# Altium project pic development board.PrjPcb
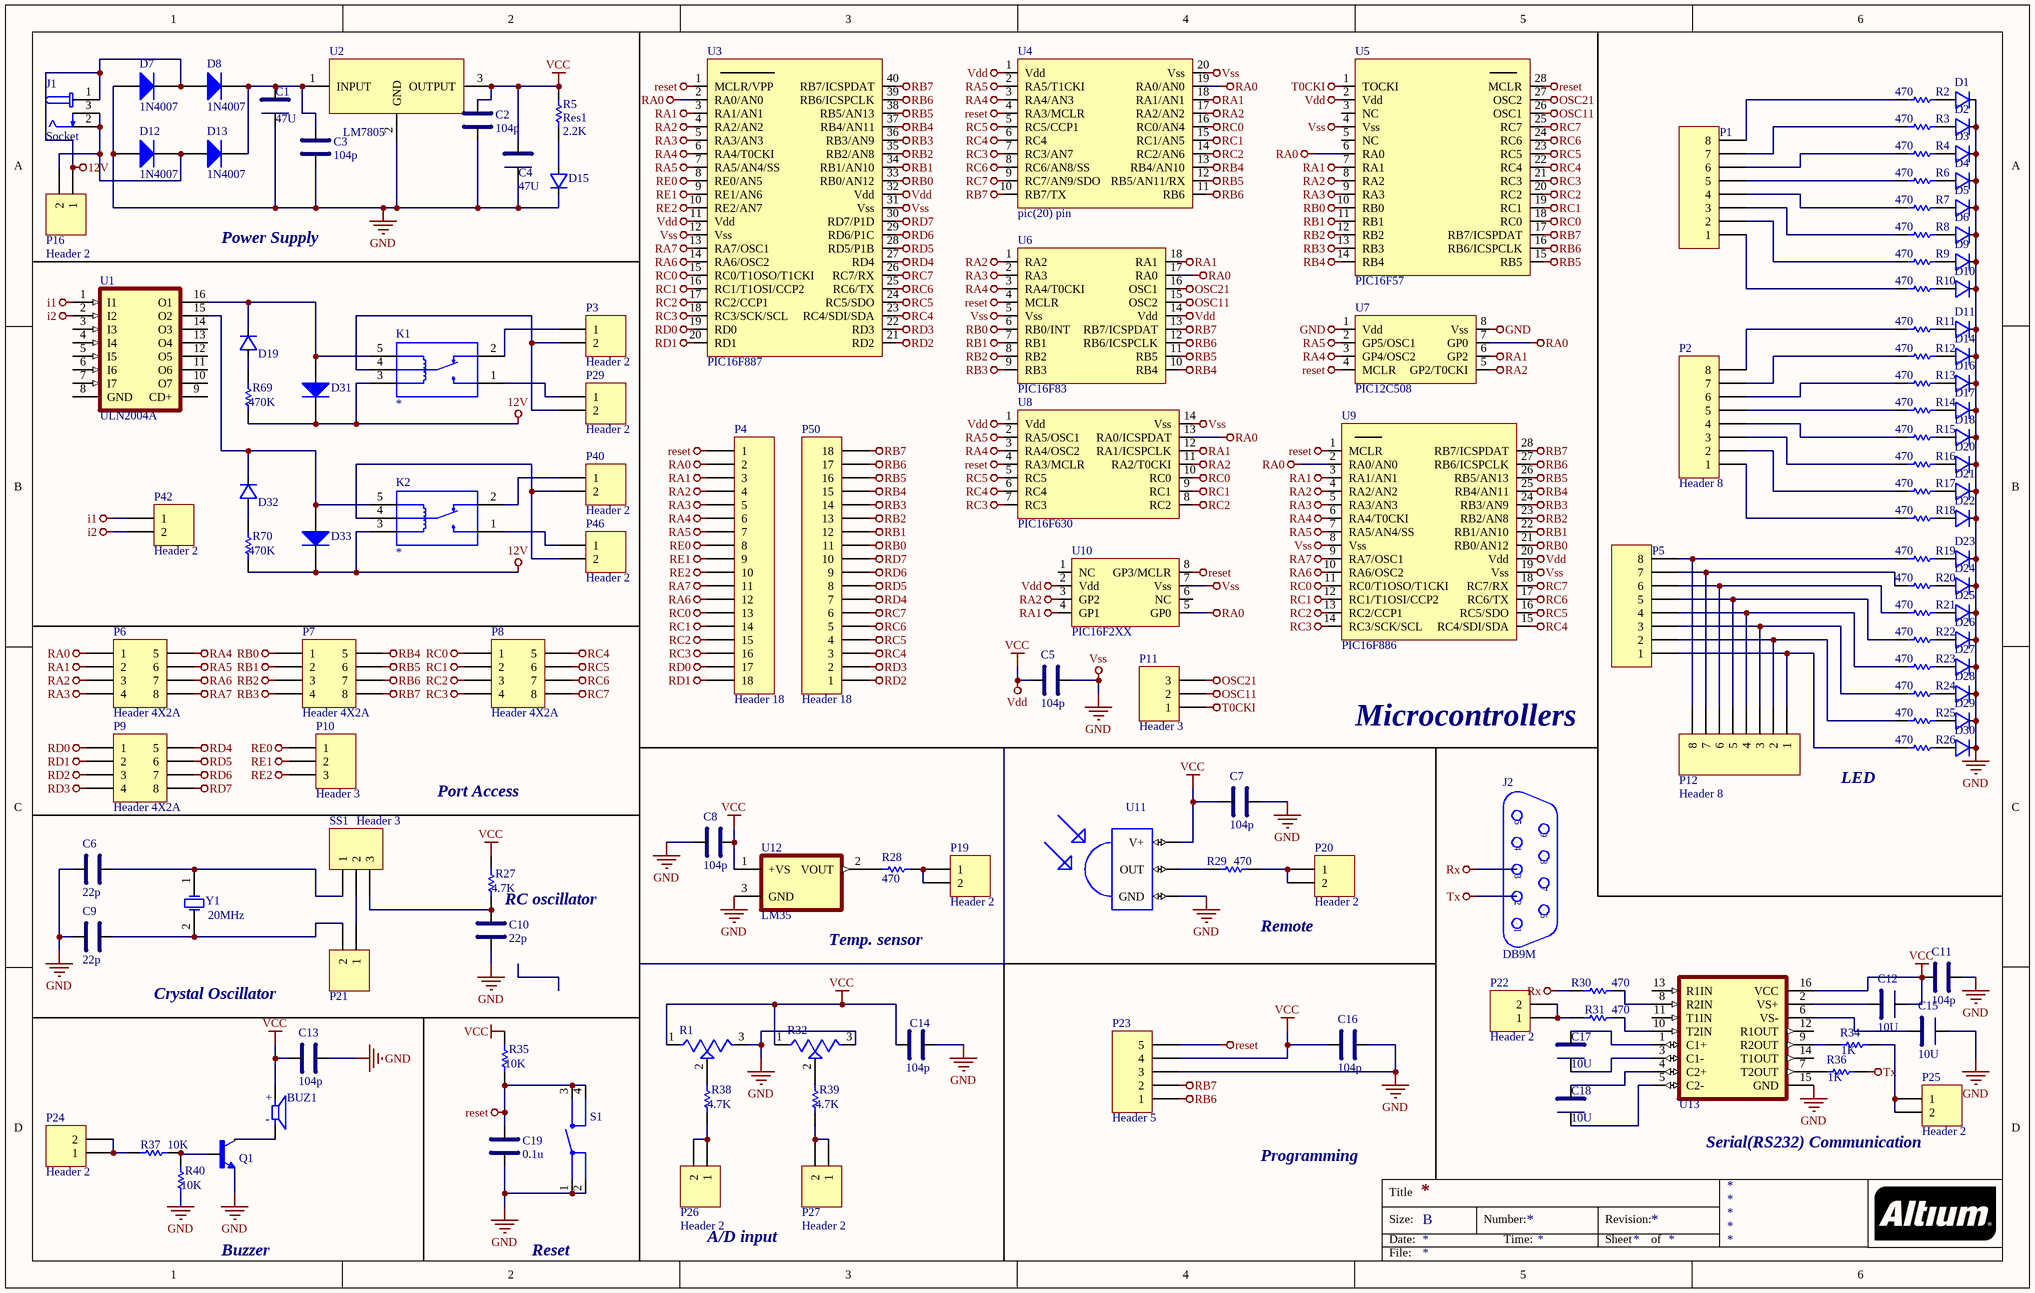
[diagram p0: Sheet1.SchDoc]
2 sheets, 266 parts. Net scope: global (net labels, ports and power ports of the same name join across sheets).
Board file: PCB1.PcbDoc
Sheets:
  Sheet1.SchDoc
  Sheet2.SchDoc

## Sheet Sheet1.SchDoc
size B

### Parts
BUZ1  CEM-1203(42)  [CUI_CEM-1203(42)]  (value not drawn)
C1  47U  [polarityCAP]
C2  value 104p  [cap]  (hidden comment: cap)
C3  104p  [cap]
C4  47U  [polarityCAP]
C5  value 104p  [cap]  (hidden comment: cap)
C6  value 22p  [cap]  (hidden comment: cap)
C7  value 104p  [cap]  (hidden comment: cap)
C8  value 104p  [cap]  (hidden comment: cap)
C9  value 22p  [cap]  (hidden comment: cap)
C10  value 22p  [cap]  (hidden comment: cap)
C11  value 104p  [cap]  (hidden comment: cap)
C12  value 10U  [polarityCAP]  (hidden comment: P.CAP)
C13  value 104p  [cap]  (hidden comment: cap)
C14  value 104p  [cap]  (hidden comment: cap)
C15  value 10U  [polarityCAP]  (hidden comment: P.CAP)
C16  value 104p  [cap]  (hidden comment: cap)
C17  value 10U  [polarityCAP]  (hidden comment: P.CAP)
C18  value 10U  [polarityCAP]  (hidden comment: P.CAP)
C19  value 0.1u  [cap]  (hidden comment: cap)
D1  LED  [PCBComponent_1]  (value not drawn)
D2  LED  [PCBComponent_1]  (value not drawn)
D3  LED  [PCBComponent_1]  (value not drawn)
D4  LED  [PCBComponent_1]  (value not drawn)
D5  LED  [PCBComponent_1]  (value not drawn)
D6  LED  [PCBComponent_1]  (value not drawn)
D7  1N4007  [DO-41]
D8  1N4007  [DO-41]
D9  LED  [PCBComponent_1]  (value not drawn)
D10  LED  [PCBComponent_1]  (value not drawn)
D11  LED  [PCBComponent_1]  (value not drawn)
D12  1N4007  [DO-41]
D13  1N4007  [DO-41]
D14  LED  [PCBComponent_1]  (value not drawn)
D15  LED  [PCBComponent_1]  (value not drawn)
D16  LED  [PCBComponent_1]  (value not drawn)
D17  LED  [PCBComponent_1]  (value not drawn)
D18  LED  [PCBComponent_1]  (value not drawn)
D19  LED  [PCBComponent_1]  (value not drawn)
D20  LED  [PCBComponent_1]  (value not drawn)
D21  LED  [PCBComponent_1]  (value not drawn)
D22  LED  [PCBComponent_1]  (value not drawn)
D23  LED  [PCBComponent_1]  (value not drawn)
D24  LED  [PCBComponent_1]  (value not drawn)
D25  LED  [PCBComponent_1]  (value not drawn)
D26  LED  [PCBComponent_1]  (value not drawn)
D27  LED  [PCBComponent_1]  (value not drawn)
D28  LED  [PCBComponent_1]  (value not drawn)
D29  LED  [PCBComponent_1]  (value not drawn)
D30  LED  [PCBComponent_1]  (value not drawn)
D31  Diode 1N4007  [DO-41]  (value not drawn)
D32  LED  [PCBComponent_1]  (value not drawn)
D33  Diode 1N4007  [DO-41]  (value not drawn)
J1  Socket  [GCT_DCJ235-05-A-XX-X_REVA]
J2  DB9M  [D-09M]
K1  1-1721150-0  [RELAY_ORWH-SH-105D1F,000]  (value not drawn)
K2  1-1721150-0  [RELAY_ORWH-SH-105D1F,000]  (value not drawn)
P1  Header 8  [HDR1X8]  (value not drawn)
P2  Header 8  [HDR1X8]
P3  Header 2  [HDR1X2]
P4  Header 18  [HDR1X18]
P5  Header 8  [HDR1X8]  (value not drawn)
P6  Header 4X2A  [HDR2X4_CEN]
P7  Header 4X2A  [HDR2X4_CEN]
P8  Header 4X2A  [HDR2X4_CEN]
P9  Header 4X2A  [HDR2X4_CEN]
P10  Header 3  [HDR1X3]
P11  Header 3  [HDR1X3]
P12  Header 8  [HDR1X8]
P16  Header 2  [HDR1X2]
P19  Header 2  [HDR1X2]
P20  Header 2  [HDR1X2]
P21  Header 2  [HDR1X2]  (value not drawn)
P22  Header 2  [HDR1X2]
P23  Header 5  [HDR1X5]
P24  Header 2  [HDR1X2]
P25  Header 2  [HDR1X2]
P26  Header 2  [HDR1X2]
P27  Header 2  [HDR1X2]
P29  Header 2  [HDR1X2]
P40  Header 2  [HDR1X2]
P42  Header 2  [HDR1X2]
P46  Header 2  [HDR1X2]
P50  Header 18  [HDR1X18]
Q1  2N5172  [TRANSISTOR_TO-92]  (value not drawn)
R1  3296W-1-103ALF  [TRIM_3296W-1-103ALF]  (value not drawn)
R2  value 470  [AXIAL-0.3]  (hidden comment: Res1)
R3  value 470  [AXIAL-0.3]  (hidden comment: Res1)
R4  value 470  [AXIAL-0.3]  (hidden comment: Res1)
R5  Res1  value 2.2K  [AXIAL-0.3]
R6  value 470  [AXIAL-0.3]  (hidden comment: Res1)
R7  value 470  [AXIAL-0.3]  (hidden comment: Res1)
R8  value 470  [AXIAL-0.3]  (hidden comment: Res1)
R9  value 470  [AXIAL-0.3]  (hidden comment: Res1)
R10  value 470  [AXIAL-0.3]  (hidden comment: Res1)
R11  value 470  [AXIAL-0.3]  (hidden comment: Res1)
R12  value 470  [AXIAL-0.3]  (hidden comment: Res1)
R13  value 470  [AXIAL-0.3]  (hidden comment: Res1)
R14  value 470  [AXIAL-0.3]  (hidden comment: Res1)
R15  value 470  [AXIAL-0.3]  (hidden comment: Res1)
R16  value 470  [AXIAL-0.3]  (hidden comment: Res1)
R17  value 470  [AXIAL-0.3]  (hidden comment: Res1)
R18  value 470  [AXIAL-0.3]  (hidden comment: Res1)
R19  value 470  [AXIAL-0.3]  (hidden comment: Res1)
R20  value 470  [AXIAL-0.3]  (hidden comment: Res1)
R21  value 470  [AXIAL-0.3]  (hidden comment: Res1)
R22  value 470  [AXIAL-0.3]  (hidden comment: Res1)
R23  value 470  [AXIAL-0.3]  (hidden comment: Res1)
R24  value 470  [AXIAL-0.3]  (hidden comment: Res1)
R25  value 470  [AXIAL-0.3]  (hidden comment: Res1)
R26  value 470  [AXIAL-0.3]  (hidden comment: Res1)
R27  value 4.7K  [AXIAL-0.3]  (hidden comment: Res1)
R28  value 470  [AXIAL-0.3]  (hidden comment: Res1)
R29  value 470  [AXIAL-0.3]  (hidden comment: Res1)
R30  value 470  [AXIAL-0.3]  (hidden comment: Res1)
R31  value 470  [AXIAL-0.3]  (hidden comment: Res1)
R32  3296W-1-103ALF  [TRIM_3296W-1-103ALF]  (value not drawn)
R34  value 1K  [AXIAL-0.3]  (hidden comment: Res1)
R35  value 10K  [AXIAL-0.3]  (hidden comment: Res1)
R36  value 1K  [AXIAL-0.3]  (hidden comment: Res1)
R37  value 10K  [AXIAL-0.3]  (hidden comment: Res1)
R38  value 4.7K  [AXIAL-0.3]  (hidden comment: Res1)
R39  value 4.7K  [AXIAL-0.3]  (hidden comment: Res1)
R40  value 10K  [AXIAL-0.3]  (hidden comment: Res1)
R69  value 470K  [AXIAL-0.3]  (hidden comment: Res1)
R70  value 470K  [AXIAL-0.3]  (hidden comment: Res1)
S1  SKHHANA010  [SW_SKHHANA010]  (value not drawn)
SS1  Header 3  [HDR1X3]
U1  ULN2004A  [ULN2004A]
U2  LM7805  [LM7805]
U3  PIC16F887  [PIC(40pin)]
U4  pic(20) pin  [PIC(20)piN]
U5  PIC16F57  [PIC(28) pin]
U6  PIC16F83  [pic16F54]
U7  PIC12C508  [PIC10F220]
U8  PIC16F630  [PIC16f630]
U9  PIC16F886  [PIC(28) pin]
U10  PIC16F2XX  [PIC10F220]
U11  1838V  [TSOP18XX]  (value not drawn)
U12  LM35  [TO127P254X495-3P]
U13  MAX232  [DIP794W45P254L1969H508Q16]  (value not drawn)
Y1  value 20MHz  [R38]  (hidden comment: XTAL)

### Nets
12V: D7.2(K) D8.1(A) D31.2(K) D33.2(K) J1.1 K1.3(C1) K2.3(C1) P16.1 R69.1 R70.1
GND: C1.2 C2.1 C3.1 C4.2 C5.1 C6.2 C7.1 C8.2 C9.2 C10.1 C11.1 C13.1 C14.1 C15.2 C16.1 C19.1 D1.2 D2.2 D3.2 D4.2 D5.2 D6.2 D7.1(A) D9.2 D10.2 D11.2 D12.1(A) D14.2 D15.2 D16.2 D17.2 D18.2 D20.2 D21.2 D22.2 D23.2 D24.2 D25.2 D26.2 D27.2 D28.2 D29.2 D30.2 P23.3 Q1.3(E) R1.3(CW) R32.3(CW) R40.1 S1.1 S1.2 U2.2(GND) U3.12(Vss) U3.31(Vss) U4.20(Vss) U5.4(Vss) U6.5(Vss) U7.1(Vdd) U7.8(Vss) U8.14(Vss) U9.8(Vss) U9.19(Vss) U10.7(Vss) U11.GND U12.3(GND) U13.15(GND)  [also labelled Vss]
i1: P42.1 U1.1(I1)
i2: P42.2 U1.2(I2)
OSC11: P11.2 U5.26(OSC1) U6.15(OSC2)
OSC21: P11.3 U5.27(OSC2) U6.16(OSC1)
RA0: P4.2 P6.1 U3.2(RA0/AN0) U4.19(RA0/AN0) U5.6(RA0) U6.17(RA0) U7.7(GP0) U8.13(RA0/ICSPDAT) U9.2(RA0/AN0) U10.5(GP0)
RA1: P4.3 P6.2 U3.3(RA1/AN1) U4.18(RA1/AN1) U5.7(RA1) U6.18(RA1) U7.6(GP2) U8.12(RA1/ICSPCLK) U9.3(RA1/AN1) U10.4(GP1)
RA2: P4.4 P6.3 U3.4(RA2/AN2) U4.17(RA2/AN2) U5.8(RA2) U6.1(RA2) U7.5(GP2/T0CKI) U8.11(RA2/T0CKI) U9.4(RA2/AN2) U10.3(GP2)
RA3: P4.5 P6.4 U3.5(RA3/AN3) U5.9(RA3) U6.2(RA3) U9.5(RA3/AN3)
RA4: P4.6 P6.5 U3.6(RA4/T0CKI) U4.3(RA4/AN3) U6.3(RA4/T0CKI) U7.3(GP4/OSC2) U8.3(RA4/OSC2) U9.6(RA4/T0CKI)
RA5: P4.7 P6.6 U3.7(RA5/AN4/SS) U4.2(RA5/T1CKI) U7.2(GP5/OSC1) U8.2(RA5/OSC1) U9.7(RA5/AN4/SS)
RA6: P4.12 P6.7 U3.14(RA6/OSC2) U9.10(RA6/OSC2)
RA7: P4.11 P6.8 U3.13(RA7/OSC1) U9.9(RA7/OSC1)
RB0: P7.1 P50.11 U3.33(RB0/AN12) U5.10(RB0) U6.6(RB0/INT) U9.21(RB0/AN12)
RB1: P7.2 P50.12 U3.34(RB1/AN10) U5.11(RB1) U6.7(RB1) U9.22(RB1/AN10)
RB2: P7.3 P50.13 U3.35(RB2/AN8) U5.12(RB2) U6.8(RB2) U9.23(RB2/AN8)
RB3: P7.4 P50.14 U3.36(RB3/AN9) U5.13(RB3) U6.9(RB3) U9.24(RB3/AN9)
RB4: P7.5 P50.15 U3.37(RB4/AN11) U4.13(RB4/AN10) U5.14(RB4) U6.10(RB4) U9.25(RB4/AN11)
RB5: P7.6 P50.16 U3.38(RB5/AN13) U4.12(RB5/AN11/RX) U5.15(RB5) U6.11(RB5) U9.26(RB5/AN13)
RB6: P7.7 P23.1 P50.17 U3.39(RB6/ICSPCLK) U4.11(RB6) U5.16(RB6/ICSPCLK) U6.12(RB6/ICSPCLK) U9.27(RB6/ICSPCLK)
RB7: P7.8 P23.2 P50.18 U3.40(RB7/ICSPDAT) U4.10(RB7/TX) U5.17(RB7/ICSPDAT) U6.13(RB7/ICSPDAT) U9.28(RB7/ICSPDAT)
RC0: P4.13 P8.1 U3.15(RC0/T1OSO/T1CKI) U4.16(RC0/AN4) U5.18(RC0) U8.10(RC0) U9.11(RC0/T1OSO/T1CKI)
RC1: P4.14 P8.2 U3.16(RC1/T1OSI/CCP2) U4.15(RC1/AN5) U5.19(RC1) U8.9(RC1) U9.12(RC1/T1OSI/CCP2)
RC2: P4.15 P8.3 U3.17(RC2/CCP1) U4.14(RC2/AN6) U5.20(RC2) U8.8(RC2) U9.13(RC2/CCP1)
RC3: P4.16 P8.4 U3.18(RC3/SCK/SCL) U4.7(RC3/AN7) U5.21(RC3) U8.7(RC3) U9.14(RC3/SCK/SCL)
RC4: P8.5 P50.3 U3.23(RC4/SDI/SDA) U4.6(RC4) U5.22(RC4) U8.6(RC4) U9.15(RC4/SDI/SDA)
RC5: P8.6 P50.4 U3.24(RC5/SDO) U4.5(RC5/CCP1) U5.23(RC5) U8.5(RC5) U9.16(RC5/SDO)
RC6: P8.7 P50.5 U3.25(RC6/TX) U4.8(RC6/AN8/SS) U5.24(RC6) U9.17(RC6/TX)
RC7: P8.8 P50.6 U3.26(RC7/RX) U4.9(RC7/AN9/SDO) U5.25(RC7) U9.18(RC7/RX)
RD0: P4.17 P9.1 U3.19(RD0)
RD1: P4.18 P9.2 U3.20(RD1)
RD2: P9.3 P50.1 U3.21(RD2)
RD3: P9.4 P50.2 U3.22(RD3)
RD4: P9.5 P50.7 U3.27(RD4)
RD5: P9.6 P50.8 U3.28(RD5/P1B)
RD6: P9.7 P50.9 U3.29(RD6/P1C)
RD7: P9.8 P50.10 U3.30(RD7/P1D)
RE0: P4.8 P10.1 U3.8(RE0/AN5)
RE1: P4.9 P10.2 U3.9(RE1/AN6)
RE2: P4.10 P10.3 U3.10(RE2/AN7)
reset: C19.2 P4.1 P23.5 R35.1 S1.3 S1.4 U3.1(MCLR/VPP) U4.4(RA3/MCLR) U5.28(MCLR) U6.4(MCLR) U7.4(MCLR) U8.4(RA3/MCLR) U9.1(MCLR) U10.8(GP3/MCLR)
Rx: J2.3 R30.1
T0CKI: P11.1 U5.1(TOCKI)
Tx: J2.2 R36.2
VCC: BUZ1.P C2.2 C4.1 C5.2 C7.2 C8.1 C11.2 C12.2 C13.2 C14.2 C16.2 P23.4 R1.1(CCW) R5.2 R27.2 R32.1(CCW) R35.2 U2.3(OUTPUT) U3.11(Vdd) U3.32(Vdd) U4.1(Vdd) U5.2(Vdd) U6.14(Vdd) U8.1(Vdd) U9.20(Vdd) U10.2(Vdd) U11.VCC(V+) U12.1(+VS) U13.16(VCC)  [also labelled Vdd]
NetBUZ1_N: BUZ1.N Q1.1(C)
NetC1_1: C1.1 C3.2 D8.2(K) D13.2(K) U2.1(INPUT)
NetC6_1: C6.1 SS1.1 Y1.1(OSC1)
NetC9_1: C9.1 P21.2 Y1.2(OSC2)
NetC10_2: C10.2 R27.1 SS1.3
NetC12_1: C12.1 U13.2(VS+)
NetC15_1: C15.1 U13.6(VS-)
NetC17_1: C17.1 U13.1(C1+)
NetC17_2: C17.2 U13.3(C1-)
NetC18_1: C18.1 U13.4(C2+)
NetC18_2: C18.2 U13.5(C2-)
NetD1_1: D1.1 R2.2
NetD2_1: D2.1 R3.2
NetD3_1: D3.1 R4.2
NetD4_1: D4.1 R6.2
NetD5_1: D5.1 R7.2
NetD6_1: D6.1 R8.2
NetD9_1: D9.1 R9.2
NetD10_1: D10.1 R10.2
NetD11_1: D11.1 R11.2
NetD12_2: D12.2(K) D13.1(A) J1.2 J1.3 P16.2
NetD14_1: D14.1 R12.2
NetD15_1: D15.1 R5.1
NetD16_1: D16.1 R13.2
NetD17_1: D17.1 R14.2
NetD18_1: D18.1 R15.2
NetD19_1: D19.1 R69.2
NetD19_2: D19.2 D31.1(A) K1.5(C2) U1.16(O1)
NetD20_1: D20.1 R16.2
NetD21_1: D21.1 R17.2
NetD22_1: D22.1 R18.2
NetD23_1: D23.1 R19.2
NetD24_1: D24.1 R20.2
NetD25_1: D25.1 R21.2
NetD26_1: D26.1 R22.2
NetD27_1: D27.1 R23.2
NetD28_1: D28.1 R24.2
NetD29_1: D29.1 R25.2
NetD30_1: D30.1 R26.2
NetD32_1: D32.1 R70.2
NetD32_2: D32.2 D33.1(A) K2.5(C2) U1.15(O2)
NetK1_1: K1.1(NO) P29.1
NetK1_2: K1.2(NC) P3.1
NetK1_4: K1.4(C) P3.2 P29.2
NetK2_1: K2.1(NO) P46.1
NetK2_2: K2.2(NC) P40.1
NetK2_4: K2.4(C) P40.2 P46.2
NetP1_1: P1.1 R10.1
NetP1_2: P1.2 R9.1
NetP1_3: P1.3 R8.1
NetP1_4: P1.4 R7.1
NetP1_5: P1.5 R6.1
NetP1_6: P1.6 R4.1
NetP1_7: P1.7 R3.1
NetP1_8: P1.8 R2.1
NetP2_1: P2.1 R18.1
NetP2_2: P2.2 R17.1
NetP2_3: P2.3 R16.1
NetP2_4: P2.4 R15.1
NetP2_5: P2.5 R14.1
NetP2_6: P2.6 R13.1
NetP2_7: P2.7 R12.1
NetP2_8: P2.8 R11.1
NetP5_1: P5.1 P12.1 R26.1
NetP5_2: P5.2 P12.2 R25.1
NetP5_3: P5.3 P12.3 R24.1
NetP5_4: P5.4 P12.4 R23.1
NetP5_5: P5.5 P12.5 R22.1
NetP5_6: P5.6 P12.6 R21.1
NetP5_7: P5.7 P12.7 R20.1
NetP5_8: P5.8 P12.8 R19.1
NetP19_1: P19.1 P19.2 R28.1
NetP20_1: P20.1 P20.2 R29.2
NetP21_1: P21.1 SS1.2
NetP22_1: P22.1 P22.2 R31.1
NetP24_1: P24.1 P24.2 R37.2
NetP25_1: P25.1 P25.2 R34.2
NetP26_1: P26.1 P26.2 R38.1
NetP27_1: P27.1 P27.2 R39.1
NetQ1_2: Q1.2(B) R37.1 R40.2
NetR1_2: R1.2(WIPER) R38.2
NetR28_2: R28.2 U12.2(VOUT)
NetR29_1: R29.1 U11.OUT
NetR30_2: R30.2 U13.8(R2IN)
NetR31_2: R31.2 U13.10(T2IN)
NetR32_2: R32.2(WIPER) R39.2
NetR34_1: R34.1 U13.9(R2OUT)
NetR36_1: R36.1 U13.7(T2OUT)

Not connected (* = marked no-connect by the designer): J2 1 4 5 6 7 8 9; U1 3(I3) 4(I4) 5(I5) 6(I6) 7(I7) 8(GND) 9(CD+) 10(O7) 11(O6) 12(O5) 13(O4) 14(O3); U5 3(NC) 5(NC); U10 1(NC) 6(NC); U13 11(T1IN) 12(R1OUT) 13(R1IN) 14(T1OUT)

### Notes on the sheet
- Power Supply
- Microcontrollers
- Port Access
- LED
- RC oscillator
- Temp. sensor
- Remote
- Crystal Oscillator
- Programming
- (near P25) Serial(RS232) Communication
- A/D input
- Buzzer
- Reset
- Title
- Size:
- Date:
- B
- Number:
- Time:
- Revision:
- Sheet
- of
- File:
- (in symbol CEM-1203(42)) +; -

### Library data of the parts
BUZ1 = CEM-1203(42): 12 mm, 3.5 V, 85 dB, Through Hole, Magnetic Audio Transducer Buzzer; MF: CUI Devices; MP: CEM-1203_42_; Value: *; Price: None; Package: TO-220 CUI Inc.; CUI_purchase_URL: https://www.cuidevices.com/product/audio/buzzers/audio-transducers/cem-1203_42_?utm_source=snapeda.com&utm_medium=referral&utm_campaign=snapedaBOM; Availability: Unavailable; SnapEDA_Link: https://www.snapeda.com/parts/CEM-1203%2842%29/CUI%20Devices/view-part/1320038/?ref=snap
C1 C4 C12 C15 C17 C18 = CAP
  C1 C4: Value: 47U
C3 = cap: Value: 104p
D7 D8 D12 D13 D31 D33 = Diode 1N4007: 1 Amp General Purpose Rectifier; Published: 8-Jun-2000; LatestRevisionDate: 17-Jul-2002; LatestRevisionNote: Re-released for DXP Platform.; DatasheetVersion: 1998; PackageVersion: Aug-1999; PackageReference: DO-41; Publisher: Altium Limited; PackageDescription: Diode, Axial; Body 5.2 x 2.7 mm (LxDia. max), Lead Dia. 0.86 mm (max); Code_JEDEC: DO-204-AL; ComponentLink1Description: Manufacturer Link; ComponentLink1URL: http://www.fairchildsemi.com/; ComponentLink2Description: Datasheet; ComponentLink2URL: http://www.fairchildsemi.com/ds/1N%2F1N4001.pdf
J1 = DCJ235-05-A-XX-X_REVA: Dc Power Jack, 5a, 20vdc, Black; MF: Global Connector Technology; MP: DCJ235-05-A-K1-A; Price: None; Availability: Unavailable; Package: None; SnapEDA_Link: https://www.snapeda.com/parts/DCJ235-05-A-K1-A/Global%20Connector%20Technology/view-part/813042/?ref=snap; Value: *
J2 = DB9M: Adapter Connector D-Sub, 9 Pin Male To D-Sub, 9 Pin Male Free Hanging _In-Line_; MF: NorComp Inc.; Package: None; Price: None; MP: DB9M; Availability: Unavailable; SnapEDA_Link: https://www.snapeda.com/parts/DB9M/NorComp%20Inc./view-part/558713/?ref=snap; Value: *
K1 K2 = ORWH-SH-105D1F,000: Electromechanical Relay 5VDC 15A SPDT __ 19.2mm 15.5mm 15mm__ THT General Purpose Relay; MF: TE Connectivity; Price: None; Value: *; TE_purchase_URL: https://www.te.com/usa-en/product-1-1721150-0.html?te_bu=Cor&te_type=disp&te_campaign=seda_glo_cor-seda-global-disp-prtnr-fy19-seda-model-bom-cta_sma-317_1&elqCampaignId=32493; Package: None; SnapEDA_Link: https://www.snapeda.com/parts/ORWH-SH-105D1F%2C000/TE%20Connectivity%20Potter%20%26%20Brumfield%20Relays/view-part/573992/?ref=snap; MP: ORWH-SH-105D1F,000; Availability: Unavailable; Comment_1: *
P1 P2 P5 P12 = Header 8: Header, 8-Pin; LatestRevisionDate: 17-Jul-2002; LatestRevisionNote: Re-released for DXP Platform.; Publisher: Altium Limited
P3 P16 P19-P22 P24-P27 P29 P40 P42 P46 = Header 2: Header, 2-Pin; LatestRevisionDate: 17-Jul-2002; LatestRevisionNote: Re-released for DXP Platform.; Publisher: Altium Limited
P4 P50 = Header 18: Header, 18-Pin; LatestRevisionDate: 17-Jul-2002; LatestRevisionNote: Re-released for DXP Platform.; Publisher: Altium Limited
P6-P9 = Header 4X2A: Header, 4-Pin, Dual row; LatestRevisionDate: 17-Jul-2002; LatestRevisionNote: Re-released for DXP Platform.; Publisher: Altium Limited
P10 P11 SS1 = Header 3: Header, 3-Pin; LatestRevisionDate: 17-Jul-2002; LatestRevisionNote: Re-released for DXP Platform.; Publisher: Altium Limited
P23 = Header 5: Header, 5-Pin; LatestRevisionDate: 17-Jul-2002; LatestRevisionNote: Re-released for DXP Platform.; Publisher: Altium Limited
Q1 = 2N5172: Bipolar (BJT) Transistor NPN 25V 500mA 625mW Through Hole TO-92-3; MF: ON Semiconductor; Package: TO-92 ON Semiconductor; DigiKey-Purchase-URL: https://snapeda.com/shop?store=DigiKey&id=2663226; Value: *; Availability: Warning; SnapEDA_Link: https://www.snapeda.com/parts/2N5172/ON%20Semiconductor/view-part/2663226/?ref=snap; Price: None; MP: 2N5172
R1 R32 = 3296W-1-103ALF: 10 kOhms 0.5W, 1 / 2W PC Pins qua lá»— Trimmer Potentiometer Cermet 25 Turn Top Äiá»u chá»‰nh; MF: Bourns; Value: *; Price: None; Package: 1005 Bourns; Mouser-Purchase-URL: https://snapeda.com/shop?store=Mouser&id=697371; Availability: Warning; SnapEDA_Link: https://www.snapeda.com/parts/3296W-1-103ALF/Bourns/view-part/697371/?ref=snap; MP: 3296W-1-103ALF
R2-R31 R34-R40 R69 R70 = Res1: Resistor; Published: 8-Jun-2000; LatestRevisionDate: 17-Jul-2002; LatestRevisionNote: Re-released for DXP Platform.; PackageReference: AXIAL-0.3; Publisher: Altium Limited; PackageDescription: Axial Device, Thru-Hole; 2 Leads; 0.3 in Pin Spacing
S1 = SKHHANA010: Switch Tactile N.O. SPST Round Button PC Pins 0.05A 12VDC 0.98N Thru-Hole Bulk; MF: ALPS; Value: *; SnapEDA_Link: https://www.snapeda.com/parts/SKHHANA010/ALPS/view-part/248805/?ref=snap; Price: None; Availability: Unavailable; Package: None; MP: SKHHANA010
U1 = ULN2004A: MF: STMicroelectronics; DigiKey-Purchase-URL: https://snapeda.com/shop?store=DigiKey&id=45236; Package: DIP-16 STMicroelectronics; MP: ULN2004A; Value: *; SnapEDA_Link: https://www.snapeda.com/parts/ULN2004A/STMicroelectronics/view-part/45236/?ref=snap; Availability: Unavailable; Price: None
U2 = Component_1
U3 = PIC(40)pin
U6 = pic(18) pin
U7 = PIC(8)pin
U8 = PIC(14) pin
U9 = PIC(28)pin
U11 = 1838V: Remote Receiver Sensor, 38.0kHz 45m Through Hole; MP: TSOP4838; MF: Vishay; Price: None; SnapEDA_Link: https://www.snapeda.com/parts/TSOP4838/Vishay%20Semiconductor%20Opto%20Division/view-part/702087/?ref=snap; Value: *; Availability: Unavailable; Package: None
U12 = LM35: &plusmn;0.5&deg;C 4V-30V, Temperature sensor with analog output 3-TO-92; MF: Texas Instruments; MP: LM35CZ/LFT1; Value: *; SnapEDA_Link: https://www.snapeda.com/parts/LM35CZ/LFT1/Texas%20Instruments/view-part/18854/?ref=snap; Texas_Instruments-Purchase-URL: https://snapeda.com/shop?store=Texas+Instruments&id=18854; Availability: Warning; Price: None; Package: TO-92-3 Texas Instruments
U13 = MAX232N: Dual EIA-232 Driver/Receiver; MF: Texas Instruments; MP: MAX232N; Availability: Unavailable; DigiKey-Purchase-URL: https://snapeda.com/shop?store=DigiKey&id=552531; SnapEDA_Link: https://www.snapeda.com/parts/MAX232N/Texas%20Instruments/view-part/552531/?ref=snap; Mouser-Purchase-URL: https://snapeda.com/shop?store=Mouser&id=552531; Value: *; Price: None; Package: PDIP-16 Texas Instruments
Y1 = XTAL: Crystal Oscillator; Published: 8-Jun-2000; LatestRevisionDate: 17-Jul-2002; LatestRevisionNote: Re-released for DXP Platform.; PackageReference: R38; Publisher: Altium Limited; PackageDescription: Crystal, Thru-Hole; 2 Leads; Body 3.1 x 8.2 mm (Dia.xH)

## Sheet Sheet2.SchDoc
size B
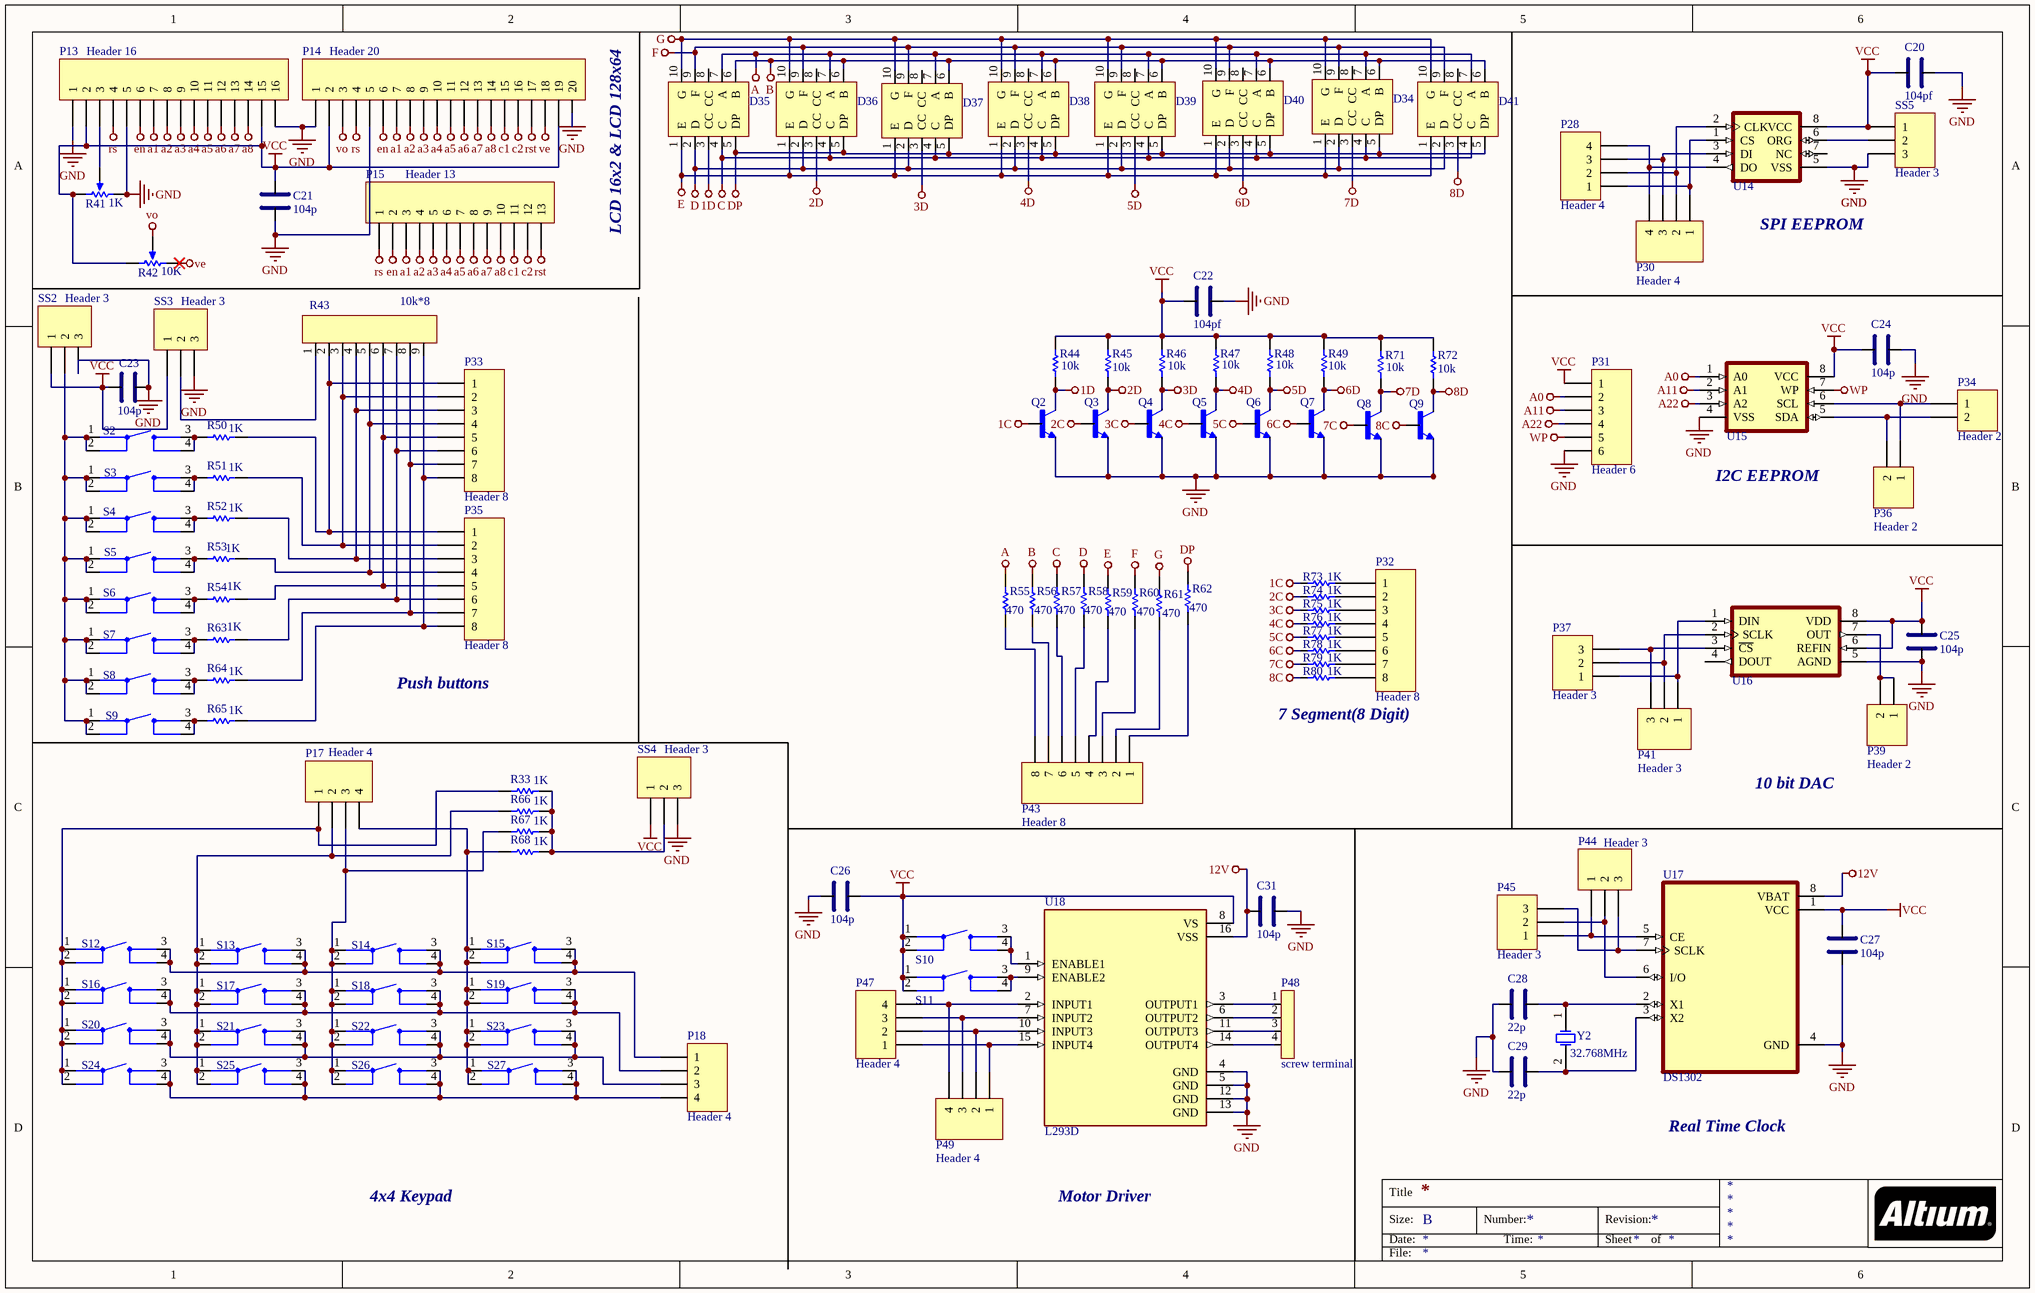
[diagram p1: Sheet2.SchDoc]

### Parts
C20  value 104pf  [cap]  (hidden comment: cap)
C21  value 104p  [cap]  (hidden comment: cap)
C22  value 104pf  [cap]  (hidden comment: cap)
C23  value 104p  [cap]  (hidden comment: cap)
C24  value 104p  [cap]  (hidden comment: cap)
C25  value 104p  [cap]  (hidden comment: cap)
C26  value 104p  [cap]  (hidden comment: cap)
C27  value 104p  [cap]  (hidden comment: cap)
C28  value 22p  [cap]  (hidden comment: cap)
C29  value 22p  [cap]  (hidden comment: cap)
C31  value 104p  [cap]  (hidden comment: cap)
D34  7seg  [LED_LTD-4708G]  (value not drawn)
D35  7seg  [LED_LTD-4708G]  (value not drawn)
D36  7seg  [LED_LTD-4708G]  (value not drawn)
D37  7seg  [LED_LTD-4708G]  (value not drawn)
D38  7seg  [LED_LTD-4708G]  (value not drawn)
D39  7seg  [LED_LTD-4708G]  (value not drawn)
D40  7seg  [LED_LTD-4708G]  (value not drawn)
D41  7seg  [LED_LTD-4708G]  (value not drawn)
P13  Header 16  [HDR1X16]
P14  Header 20  [HDR1X20]
P15  Header 13  [HDR1X13]
P17  Header 4  [HDR1X4]
P18  Header 4  [HDR1X4]
P28  Header 4  [HDR1X4]
P30  Header 4  [HDR1X4]
P31  Header 6  [HDR1X6]
P32  Header 8  [HDR1X8]
P33  Header 8  [HDR1X8]
P34  Header 2  [HDR1X2]
P35  Header 8  [HDR1X8]
P36  Header 2  [HDR1X2]
P37  Header 3  [HDR1X3]
P39  Header 2  [HDR1X2]
P41  Header 3  [HDR1X3]
P43  Header 8  [HDR1X8]
P44  Header 3  [HDR1X3]
P45  Header 3  [HDR1X3]
P47  Header 4  [HDR1X4]
P48  screw terminal  [screw library]
P49  Header 4  [HDR1X4]
Q2  2N5172  [TRANSISTOR_TO-92]  (value not drawn)
Q3  2N5172  [TRANSISTOR_TO-92]  (value not drawn)
Q4  2N5172  [TRANSISTOR_TO-92]  (value not drawn)
Q5  2N5172  [TRANSISTOR_TO-92]  (value not drawn)
Q6  2N5172  [TRANSISTOR_TO-92]  (value not drawn)
Q7  2N5172  [TRANSISTOR_TO-92]  (value not drawn)
Q8  2N5172  [TRANSISTOR_TO-92]  (value not drawn)
Q9  2N5172  [TRANSISTOR_TO-92]  (value not drawn)
R33  value 1K  [AXIAL-0.3]  (hidden comment: Res1)
R41  value 1K  [VR5]  (hidden comment: RPot)
R42  value 10K  [VR5]  (hidden comment: RPot)
R43  value 10k*8  [10k sip]  (hidden comment: 10k sip)
R44  value 10k  [AXIAL-0.3]  (hidden comment: Res1)
R45  value 10k  [AXIAL-0.3]  (hidden comment: Res1)
R46  value 10k  [AXIAL-0.3]  (hidden comment: Res1)
R47  value 10k  [AXIAL-0.3]  (hidden comment: Res1)
R48  value 10k  [AXIAL-0.3]  (hidden comment: Res1)
R49  value 10k  [AXIAL-0.3]  (hidden comment: Res1)
R50  value 1K  [AXIAL-0.3]  (hidden comment: Res1)
R51  value 1K  [AXIAL-0.3]  (hidden comment: Res1)
R52  value 1K  [AXIAL-0.3]  (hidden comment: Res1)
R53  value 1K  [AXIAL-0.3]  (hidden comment: Res1)
R54  value 1K  [AXIAL-0.3]  (hidden comment: Res1)
R55  value 470  [AXIAL-0.3]  (hidden comment: Res1)
R56  value 470  [AXIAL-0.3]  (hidden comment: Res1)
R57  value 470  [AXIAL-0.3]  (hidden comment: Res1)
R58  value 470  [AXIAL-0.3]  (hidden comment: Res1)
R59  value 470  [AXIAL-0.3]  (hidden comment: Res1)
R60  value 470  [AXIAL-0.3]  (hidden comment: Res1)
R61  value 470  [AXIAL-0.3]  (hidden comment: Res1)
R62  value 470  [AXIAL-0.3]  (hidden comment: Res1)
R63  value 1K  [AXIAL-0.3]  (hidden comment: Res1)
R64  value 1K  [AXIAL-0.3]  (hidden comment: Res1)
R65  value 1K  [AXIAL-0.3]  (hidden comment: Res1)
R66  value 1K  [AXIAL-0.3]  (hidden comment: Res1)
R67  value 1K  [AXIAL-0.3]  (hidden comment: Res1)
R68  value 1K  [AXIAL-0.3]  (hidden comment: Res1)
R71  value 10k  [AXIAL-0.3]  (hidden comment: Res1)
R72  value 10k  [AXIAL-0.3]  (hidden comment: Res1)
R73  value 1K  [AXIAL-0.3]  (hidden comment: Res1)
R74  value 1K  [AXIAL-0.3]  (hidden comment: Res1)
R75  value 1K  [AXIAL-0.3]  (hidden comment: Res1)
R76  value 1K  [AXIAL-0.3]  (hidden comment: Res1)
R77  value 1K  [AXIAL-0.3]  (hidden comment: Res1)
R78  value 1K  [AXIAL-0.3]  (hidden comment: Res1)
R79  value 1K  [AXIAL-0.3]  (hidden comment: Res1)
R80  value 1K  [AXIAL-0.3]  (hidden comment: Res1)
S2  SKHHANA010  [buttons]  (value not drawn)
S3  SKHHANA010  [buttons]  (value not drawn)
S4  SKHHANA010  [buttons]  (value not drawn)
S5  SKHHANA010  [buttons]  (value not drawn)
S6  SKHHANA010  [buttons]  (value not drawn)
S7  SKHHANA010  [buttons]  (value not drawn)
S8  SKHHANA010  [buttons]  (value not drawn)
S9  SKHHANA010  [buttons]  (value not drawn)
S10  SKHHANA010  [buttons]  (value not drawn)
S11  SKHHANA010  [buttons]  (value not drawn)
S12  SKHHANA010  [buttons]  (value not drawn)
S13  SKHHANA010  [buttons]  (value not drawn)
S14  SKHHANA010  [buttons]  (value not drawn)
S15  SKHHANA010  [buttons]  (value not drawn)
S16  SKHHANA010  [buttons]  (value not drawn)
S17  SKHHANA010  [buttons]  (value not drawn)
S18  SKHHANA010  [buttons]  (value not drawn)
S19  SKHHANA010  [buttons]  (value not drawn)
S20  SKHHANA010  [buttons]  (value not drawn)
S21  SKHHANA010  [buttons]  (value not drawn)
S22  SKHHANA010  [buttons]  (value not drawn)
S23  SKHHANA010  [buttons]  (value not drawn)
S24  SKHHANA010  [buttons]  (value not drawn)
S25  SKHHANA010  [buttons]  (value not drawn)
S26  SKHHANA010  [buttons]  (value not drawn)
S27  SKHHANA010  [buttons]  (value not drawn)
SS2  Header 3  [HDR1X3]
SS3  Header 3  [HDR1X3]
SS4  Header 3  [HDR1X3]
SS5  Header 3  [HDR1X3]
U14  93LC46A/P  [PIC10F220]  (value not drawn)
U15  24AA1025  [PIC10F220]  (value not drawn)
U16  TLC5615  [PIC10F220]  (value not drawn)
U17  DS1302  [PIC10F220]
U18  L293D  [L293D]
Y2  value 32.768MHz  [R38]  (hidden comment: XTAL)

### Nets
1C: Q2.2(B) R73.1
1D: D35.3(CC) Q2.1(C) R44.1
2C: Q3.2(B) R74.1
2D: D36.3(CC) Q3.1(C) R45.1
3C: Q4.2(B) R75.1
3D: D37.3(CC) Q4.1(C) R46.1
4C: Q5.2(B) R76.1
4D: D38.3(CC) Q5.1(C) R47.1
5C: Q6.2(B) R77.1
5D: D39.3(CC) Q6.1(C) R48.1
6C: Q7.2(B) R78.1
6D: D40.3(CC) Q7.1(C) R49.1
7C: Q8.2(B) R79.1
7D: D34.3(CC) Q8.1(C) R71.1
8C: Q9.2(B) R80.1
8D: D41.3(CC) Q9.1(C) R72.1
12V: C31.2 U17.8(VBAT) U18.16(VSS)
A: D34.7(A) D35.7(A) D36.7(A) D37.7(A) D38.7(A) D39.7(A) D40.7(A) D41.7(A) R55.2
A0: P31.2 U15.1(A0)
a1: P13.7 P14.7 P15.3
a2: P13.8 P14.8 P15.4
a3: P13.9 P14.9 P15.5
a4: P13.10 P14.10 P15.6
a5: P13.11 P14.11 P15.7
a6: P13.12 P14.12 P15.8
a7: P13.13 P14.13 P15.9
a8: P13.14 P14.14 P15.10
A11: P31.3 U15.2(A1)
A22: P31.4 U15.3(A2)
B: D34.6(B) D35.6(B) D36.6(B) D37.6(B) D38.6(B) D39.6(B) D40.6(B) D41.6(B) R56.2
C: D34.4(C) D35.4(C) D36.4(C) D37.4(C) D38.4(C) D39.4(C) D40.4(C) D41.4(C) R57.2
c1: P14.15 P15.11
c2: P14.16 P15.12
D: D34.2(D) D35.2(D) D36.2(D) D37.2(D) D38.2(D) D39.2(D) D40.2(D) D41.2(D) R58.2
DP: D34.5(DP) D35.5(DP) D36.5(DP) D37.5(DP) D38.5(DP) D39.5(DP) D40.5(DP) D41.5(DP) R62.2
E: D34.1(E) D35.1(E) D36.1(E) D37.1(E) D38.1(E) D39.1(E) D40.1(E) D41.1(E) R59.2
en: P13.6 P14.6 P15.2
F: D34.9(F) D35.9(F) D36.9(F) D37.9(F) D38.9(F) D39.9(F) D40.9(F) D41.9(F) R60.2
G: D34.10(G) D35.10(G) D36.10(G) D37.10(G) D38.10(G) D39.10(G) D40.10(G) D41.10(G) R61.2
GND: C20.1 C21.1 C22.1 C23.1 C24.1 C25.1 C26.2 C27.1 C28.2 C29.2 C31.1 P13.1 P13.5 P13.16 P14.1 P14.5 P14.20 P31.6 Q2.3(E) Q3.3(E) Q4.3(E) Q5.3(E) Q6.3(E) Q7.3(E) Q8.3(E) Q9.3(E) R41.1(TOP) SS2.3 SS3.3 SS4.3 SS5.3 U14.5(VSS) U15.4(VSS) U16.5(AGND) U17.4(GND) U18.4(GND) U18.5(GND) U18.12(GND) U18.13(GND)
rs: P13.4 P14.4 P15.1
rst: P14.17 P15.13
VCC: C20.2 C21.2 C22.2 C23.2 C24.2 C25.2 C26.1 C27.2 P13.2 P13.15 P14.2 P14.19 P31.1 R41.2(BOT) R42.2(BOT) R44.2 R45.2 R46.2 R47.2 R48.2 R49.2 R71.2 R72.2 S10.1 S10.2 S11.1 S11.2 SS2.1 SS3.1 SS4.1 SS5.1 U14.8(VCC) U15.8(VCC) U16.6(REFIN) U16.8(VDD) U17.1(VCC) U18.8(VS)
ve: P14.18 R42.1(TOP)
vo: P14.3 R42.3(TAP)
WP: P31.5 U15.7(WP)
NetC28_1: C28.1 U17.2(X1) Y2.1(OSC1)
NetC29_1: C29.1 U17.3(X2) Y2.2(OSC2)
NetP13_3: P13.3 R41.3(TAP)
NetP17_1: P17.1 R33.1 S12.1 S12.2 S16.1 S16.2 S20.1 S20.2 S24.1 S24.2
NetP17_2: P17.2 R66.1 S13.1 S13.2 S17.1 S17.2 S21.1 S21.2 S25.1 S25.2
NetP17_3: P17.3 R67.1 S14.1 S14.2 S18.1 S18.2 S22.1 S22.2 S26.1 S26.2
NetP17_4: P17.4 R68.1 S15.1 S15.2 S19.1 S19.2 S23.1 S23.2 S27.1 S27.2
NetP18_1: P18.1 S12.3 S12.4 S13.3 S13.4 S14.3 S14.4 S15.3 S15.4
NetP18_2: P18.2 S16.3 S16.4 S17.3 S17.4 S18.3 S18.4 S19.3 S19.4
NetP18_3: P18.3 S20.3 S20.4 S21.3 S21.4 S22.3 S22.4 S23.3 S23.4
NetP18_4: P18.4 S24.3 S24.4 S25.3 S25.4 S26.3 S26.4 S27.3 S27.4
NetP28_1: P28.1 P30.1 U14.1(CS)
NetP28_2: P28.2 P30.2 U14.2(CLK)
NetP28_3: P28.3 P30.3 U14.3(DI)
NetP28_4: P28.4 P30.4 U14.4(DO)
NetP32_1: P32.1 R73.2
NetP32_2: P32.2 R74.2
NetP32_3: P32.3 R75.2
NetP32_4: P32.4 R76.2
NetP32_5: P32.5 R77.2
NetP32_6: P32.6 R78.2
NetP32_7: P32.7 R79.2
NetP32_8: P32.8 R80.2
NetP33_1: P33.1 P35.1 R43.2 R50.2
NetP33_2: P33.2 P35.2 R43.3 R51.2
NetP33_3: P33.3 P35.3 R43.4 R52.2
NetP33_4: P33.4 P35.4 R43.5 R53.2
NetP33_5: P33.5 P35.5 R43.6 R54.2
NetP33_6: P33.6 P35.6 R43.7 R63.2
NetP33_7: P33.7 P35.7 R43.8 R64.2
NetP33_8: P33.8 P35.8 R43.9 R65.2
NetP34_1: P34.1 P36.1 U15.6(SCL)
NetP34_2: P34.2 P36.2 U15.5(SDA)
NetP37_1: P37.1 P41.1 U16.1(DIN)
NetP37_2: P37.2 P41.2 U16.2(SCLK)
NetP37_3: P37.3 P41.3 U16.3(~{CS})
NetP39_1: P39.1 P39.2 U16.7(OUT)
NetP43_1: P43.1 R62.1
NetP43_2: P43.2 R61.1
NetP43_3: P43.3 R60.1
NetP43_4: P43.4 R59.1
NetP43_5: P43.5 R58.1
NetP43_6: P43.6 R57.1
NetP43_7: P43.7 R56.1
NetP43_8: P43.8 R55.1
NetP44_1: P44.1 P45.1 U17.5(CE)
NetP44_2: P44.2 P45.2 U17.6(I/O)
NetP44_3: P44.3 P45.3 U17.7(SCLK)
NetP47_1: P47.1 P49.1 U18.15(INPUT4)
NetP47_2: P47.2 P49.2 U18.10(INPUT3)
NetP47_3: P47.3 P49.3 U18.7(INPUT2)
NetP47_4: P47.4 P49.4 U18.2(INPUT1)
NetP48_1: P48.1 U18.3(OUTPUT1)
NetP48_2: P48.2 U18.6(OUTPUT2)
NetP48_3: P48.3 U18.11(OUTPUT3)
NetP48_4: P48.4 U18.14(OUTPUT4)
NetR33_2: R33.2 R66.2 R67.2 R68.2 SS4.2
NetR43_1: R43.1 SS3.2
NetR50_1: R50.1 S2.3 S2.4
NetR51_1: R51.1 S3.3 S3.4
NetR52_1: R52.1 S4.3 S4.4
NetR53_1: R53.1 S5.3 S5.4
NetR54_1: R54.1 S6.3 S6.4
NetR63_1: R63.1 S7.3 S7.4
NetR64_1: R64.1 S8.3 S8.4
NetR65_1: R65.1 S9.3 S9.4
NetS2_1: S2.1 S2.2 S3.1 S3.2 S4.1 S4.2 S5.1 S5.2 S6.1 S6.2 S7.1 S7.2 S8.1 S8.2 S9.1 S9.2 SS2.2
NetS10_3: S10.3 S10.4 U18.1(ENABLE1)
NetS11_3: S11.3 S11.4 U18.9(ENABLE2)
NetSS5_2: SS5.2 U14.6(ORG)

Not connected (* = marked no-connect by the designer): D34 8(CC); D35 8(CC); D36 8(CC); D37 8(CC); D38 8(CC); D39 8(CC); D40 8(CC); D41 8(CC); U14 7(NC); U16 4(DOUT)

### Notes on the sheet
- LCD 16x2 & LCD 128x64
- SPI EEPROM
- (near U15) I2C EEPROM
- (near P35) Push buttons
- 7 Segment(8 Digit)
- 10 bit DAC
- Real Time Clock
- 4x4 Keypad
- Motor Driver
- Title
- Size:
- Date:
- B
- Number:
- Time:
- Revision:
- Sheet
- of
- File:

### Library data of the parts
P13 = Header 16: Header, 16-Pin; LatestRevisionDate: 17-Jul-2002; LatestRevisionNote: Re-released for DXP Platform.; Publisher: Altium Limited
P14 = Header 20: Header, 20-Pin; LatestRevisionDate: 17-Jul-2002; LatestRevisionNote: Re-released for DXP Platform.; Publisher: Altium Limited
P15 = Header 13: Header, 13-Pin; LatestRevisionDate: 17-Jul-2002; LatestRevisionNote: Re-released for DXP Platform.; Publisher: Altium Limited
P17 P18 P28 P30 P47 P49 = Header 4: Header, 4-Pin; LatestRevisionDate: 17-Jul-2002; LatestRevisionNote: Re-released for DXP Platform.; Publisher: Altium Limited
P31 = Header 6: Header, 6-Pin; LatestRevisionDate: 17-Jul-2002; LatestRevisionNote: Re-released for DXP Platform.; Publisher: Altium Limited
P32 P33 P35 P43 = Header 8: Header, 8-Pin; LatestRevisionDate: 17-Jul-2002; LatestRevisionNote: Re-released for DXP Platform.; Publisher: Altium Limited
P34 P36 P39 = Header 2: Header, 2-Pin; LatestRevisionDate: 17-Jul-2002; LatestRevisionNote: Re-released for DXP Platform.; Publisher: Altium Limited
P37 P41 P44 P45 SS2-SS5 = Header 3: Header, 3-Pin; LatestRevisionDate: 17-Jul-2002; LatestRevisionNote: Re-released for DXP Platform.; Publisher: Altium Limited
Q2-Q9 = 2N5172: as Q1 on sheet Sheet1; Package: TO-92 ON Semiconductor; DigiKey-Purchase-URL: https://snapeda.com/shop?store=DigiKey&id=2663226; Value: *; Availability: Warning; SnapEDA_Link: https://www.snapeda.com/parts/2N5172/ON%20Semiconductor/view-part/2663226/?ref=snap; Price: None; MP: 2N5172
R33 R44-R68 R71-R80 = Res1: Resistor; Published: 8-Jun-2000; LatestRevisionDate: 17-Jul-2002; LatestRevisionNote: Re-released for DXP Platform.; PackageReference: AXIAL-0.3; Publisher: Altium Limited
  R33 R44-R54 R56-R67 R71-R80: PackageDescription: Axial Device, Thru-Hole; 2 Leads; 0.3 in Pin Spacing
  R55: PackageDescription: TH.HOLE
  R68: PackageDescription: Axial Device, Thru-Hole; 2 Leads; 0.3 in Pin Spacing; PACKAGE: TH.HOLE
R41 R42 = RPot: Potentiometer; Sim Note: Enter the Resistance value and the set point into parameter fields.; Set Position: 0.5; Published: 8-Jun-2000; LatestRevisionDate: 17-Jul-2002; LatestRevisionNote: Re-released for DXP Platform.; PackageReference: VR5; Publisher: Altium Limited; PackageDescription: Variable Resistor, Thru-Hole; 3 Leads
S2-S27 = SKHHANA010: as S1 on sheet Sheet1; Value: *; SnapEDA_Link: https://www.snapeda.com/parts/SKHHANA010/ALPS/view-part/248805/?ref=snap; Price: None; Availability: Unavailable; Package: None; MP: SKHHANA010
U14 = 93LC46A/P: EEPROM Memory IC 1Kb (128 x 8) SPI 2MHz 8-PDIP; MF: Microchip; Value: *; Check_prices: https://www.snapeda.com/parts/93LC46A/P/Microchip/view-part/184688/?ref=eda; Availability: Good; Price: None; MP: 93LC46A/P; Package: DIP-8 Microchip; Purchase-URL: https://pricing.snapeda.com/search/part/93LC46A/P/?ref=eda; SnapEDA_Link: https://www.snapeda.com/parts/93LC46A/P/Microchip/view-part/184688/?ref=snap
U15 = 24AA1025-I/P: EEPROM Memory IC 1Mb (128K x 8) IÂ²C 400kHz 900ns 8-PDIP; MF: Microchip; MP: 24AA1025-I/P; Purchase-URL: https://pricing.snapeda.com/search/part/24AA1025-I/P/?ref=eda; Price: None; SnapEDA_Link: https://www.snapeda.com/parts/24AA1025-I/P/Microchip/view-part/1178/?ref=snap; Package: DIP-8 Microchip; Availability: Warning; Check_prices: https://www.snapeda.com/parts/24AA1025-I/P/Microchip/view-part/1178/?ref=eda; Value: *
U16 = TLC5615CP: 10-bit, single-channel, low-power DAC with 12.5us settling time and power-on reset 8-PDIP 0 to 70; MF: Texas Instruments; MP: TLC5615CP; Purchase-URL: https://pricing.snapeda.com/search/part/TLC5615CP/?ref=eda; Price: None; SnapEDA_Link: https://www.snapeda.com/parts/TLC5615CP/Texas%20Instruments/view-part/480984/?ref=snap; Check_prices: https://www.snapeda.com/parts/TLC5615CP/Texas%20Instruments/view-part/480984/?ref=eda; Package: PDIP-8 Texas; Availability: Warning; Value: *
U17 = DS1302: Real Time Clock _RTC_ IC Clock/Calendar 31B 8-DIP _0.300, 7.62mm_; MP: DS1302+; MF: Maxim Integrated; Digi-Key_Part_Number: DS1302+-ND; Value: *; SnapEDA_Link: https://www.snapeda.com/parts/DS1302%2B/Maxim%20Integrated/view-part/211653/?ref=snap; Digi-Key_Purchase_URL: https://www.digikey.co.id/product-detail/en/maxim-integrated/DS1302-/DS1302--ND/956878?utm_source=snapeda&utm_medium=aggregator&utm_campaign=symbol; Package: PDIP-8 Maxim
Y2 = XTAL: Crystal Oscillator; Published: 8-Jun-2000; LatestRevisionDate: 17-Jul-2002; LatestRevisionNote: Re-released for DXP Platform.; PackageReference: R38; Publisher: Altium Limited; PackageDescription: Crystal, Thru-Hole; 2 Leads; Body 3.1 x 8.2 mm (Dia.xH)

## Nets that join several sheets
12V: Sheet1 (10 pins), Sheet2 (C31.2 U17.8 U18.16)
GND: Sheet1 (65 pins), Sheet2 (39 pins)
VCC: Sheet1 (29 pins), Sheet2 (37 pins)